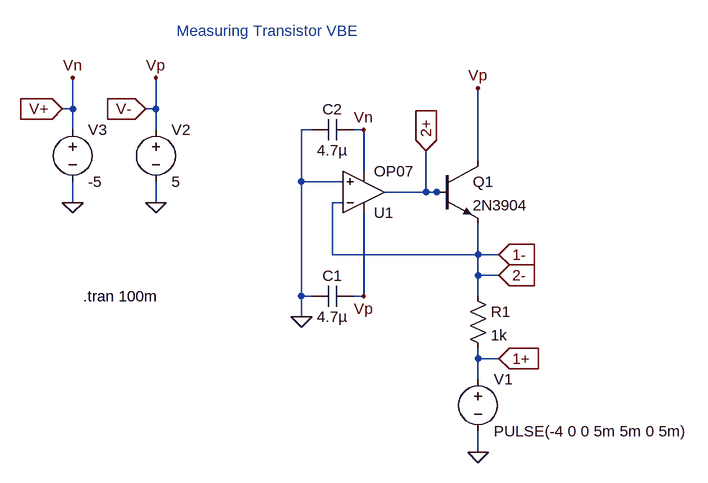
[diagram p0: schematic meas_vbe.asc]
meas_vbe.asc, the LTspice schematic file:
Version 4
SHEET 1 880 680
WIRE -288 -400 -288 -448
WIRE -288 -400 -304 -400
WIRE -160 -400 -160 -448
WIRE -160 -400 -176 -400
WIRE -288 -368 -288 -400
WIRE -160 -368 -160 -400
WIRE 80 -368 64 -368
WIRE 160 -368 144 -368
WIRE 336 -320 336 -432
WIRE 160 -304 160 -368
WIRE 64 -288 64 -368
WIRE 128 -288 64 -288
WIRE 256 -272 256 -336
WIRE 256 -272 192 -272
WIRE 272 -272 256 -272
WIRE 288 -272 272 -272
WIRE -288 -256 -288 -288
WIRE -160 -256 -160 -288
WIRE 128 -256 112 -256
WIRE 112 -176 112 -256
WIRE 336 -176 336 -224
WIRE 336 -176 112 -176
WIRE 368 -176 336 -176
WIRE 336 -144 336 -176
WIRE 368 -144 336 -144
WIRE 64 -112 64 -288
WIRE 80 -112 64 -112
WIRE 160 -112 160 -240
WIRE 160 -112 144 -112
WIRE 336 -112 336 -144
WIRE 64 -80 64 -112
WIRE 336 -16 336 -32
WIRE 368 -16 336 -16
WIRE 336 16 336 -16
WIRE 336 128 336 96
FLAG 336 128 0
FLAG 64 -80 0
FLAG -160 -256 0
FLAG -288 -256 0
FLAG -160 -448 Vp
FLAG -288 -448 Vn
FLAG 160 -112 Vp
FLAG 160 -368 Vn
FLAG -304 -400 V+
IOPIN -304 -400 In
FLAG -176 -400 V-
IOPIN -176 -400 In
FLAG 336 -432 Vp
FLAG 256 -336 2+
IOPIN 256 -336 In
FLAG 368 -176 1-
IOPIN 368 -176 In
FLAG 368 -144 2-
IOPIN 368 -144 In
FLAG 368 -16 1+
IOPIN 368 -16 In
SYMBOL voltage 336 0 R0
WINDOW 123 0 0 Left 0
WINDOW 39 0 0 Left 0
SYMATTR InstName V1
SYMATTR Value PULSE(-4 0 0 5m 5m 0 5m)
SYMBOL res 320 -128 R0
SYMATTR InstName R1
SYMATTR Value 1k
SYMBOL Opamps\\OP07 160 -208 M180
SYMATTR InstName U1
SYMBOL cap 144 -128 R90
WINDOW 0 0 32 VBottom 2
WINDOW 3 32 32 VTop 2
SYMATTR InstName C1
SYMATTR Value 4.7µ
SYMBOL cap 144 -384 R90
WINDOW 0 0 32 VBottom 2
WINDOW 3 32 32 VTop 2
SYMATTR InstName C2
SYMATTR Value 4.7µ
SYMBOL voltage -160 -384 R0
WINDOW 123 0 0 Left 0
WINDOW 39 0 0 Left 0
SYMATTR InstName V2
SYMATTR Value 5
SYMBOL voltage -288 -384 R0
WINDOW 123 0 0 Left 0
WINDOW 39 0 0 Left 0
SYMATTR InstName V3
SYMATTR Value -5
SYMBOL npn 272 -320 R0
SYMATTR InstName Q1
SYMATTR Value 2N3904
TEXT -272 -112 Left 2 !.tran 100m
TEXT -128 -520 Left 2 ;Measuring Transistor VBE

The netlist it stands for:
* meas_vbe.asc
V1 1+ 0 PULSE(-4 0 0 5m 5m 0 5m)
R1 2- 1+ 1k
XU1 0 2- V- V+ 2+ LT1001  ; OP07, pins In+ In- V+ V- OUT
C1 V- 0 4.7µ
C2 V+ 0 4.7µ
V2 V- 0 5
V3 V+ 0 -5
Q1 V- 2+ 2- 0 2N3904
.model NPN NPN
.model PNP PNP
.lib standard.bjt
.tran 100m
* Measuring Transistor VBE
.lib LTC.lib
.backanno
.end